# Altium project rj45_hub.PrjPcb
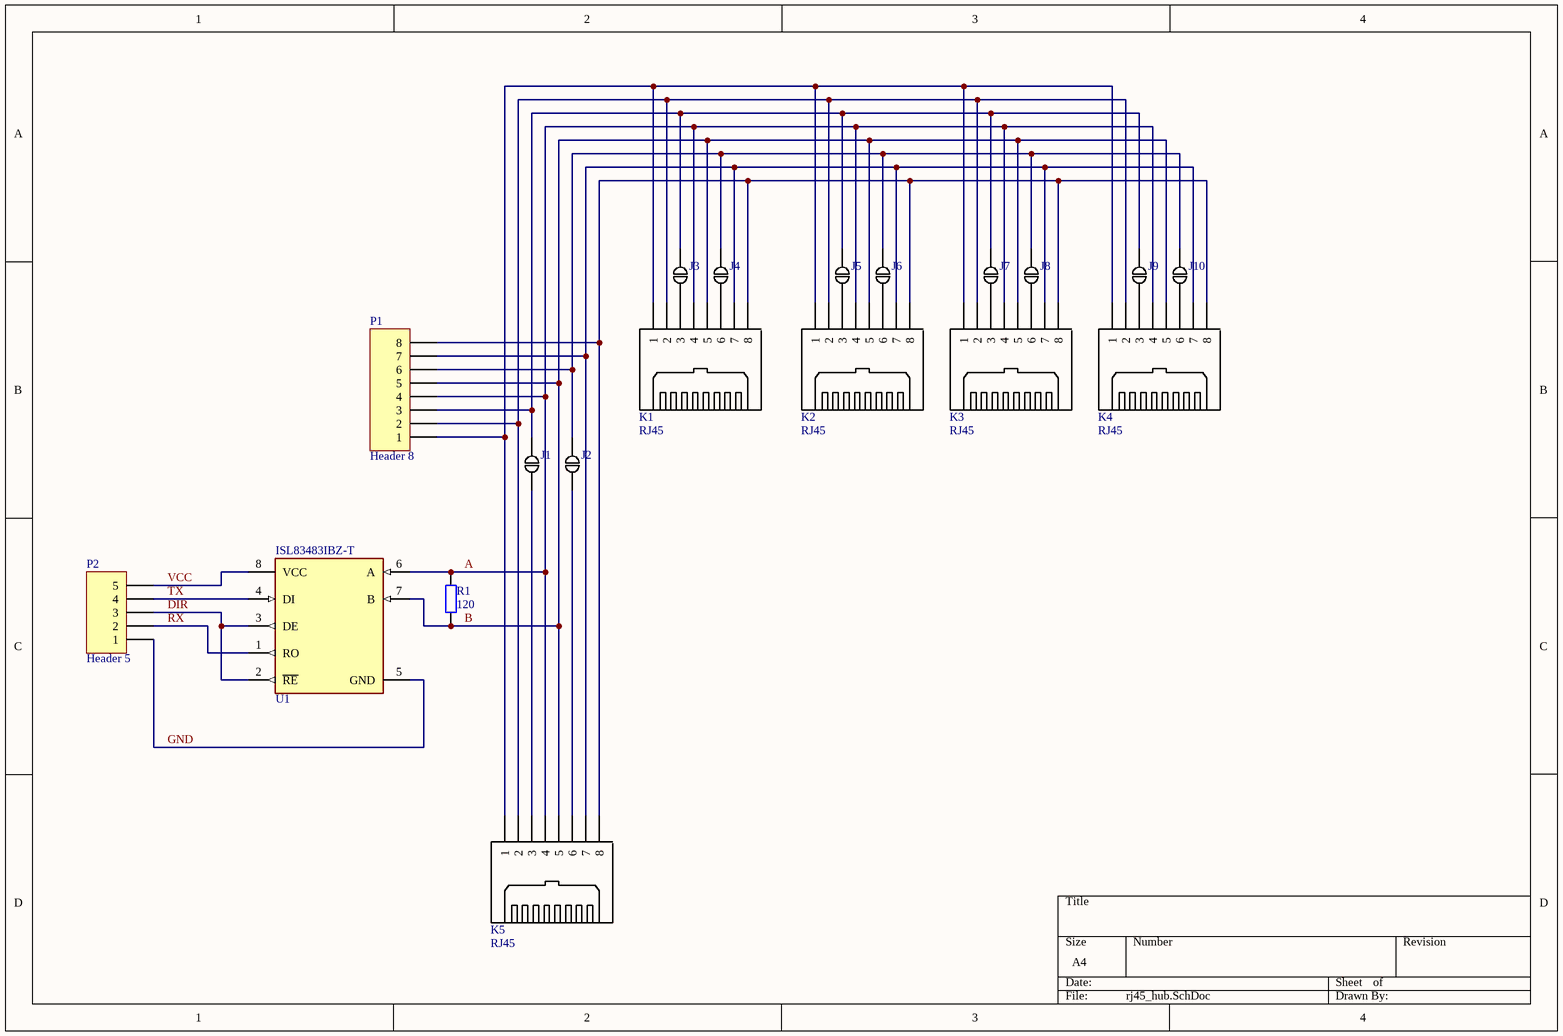
[diagram p0: rj45_hub.SchDoc]
1 sheet, 19 parts. Net scope: global (net labels, ports and power ports of the same name join across sheets).

## Sheet rj45_hub.SchDoc
size A4

### Parts
J1  (no value)  [SOLDER_JUMP]
J2  (no value)  [SOLDER_JUMP]
J3  (no value)  [SOLDER_JUMP]
J4  (no value)  [SOLDER_JUMP]
J5  (no value)  [SOLDER_JUMP]
J6  (no value)  [SOLDER_JUMP]
J7  (no value)  [SOLDER_JUMP]
J8  (no value)  [SOLDER_JUMP]
J9  (no value)  [SOLDER_JUMP]
J10  (no value)  [SOLDER_JUMP]
K1  RJ45  [rj45]
K2  RJ45  [rj45]
K3  RJ45  [rj45]
K4  RJ45  [rj45]
K5  RJ45  [rj45]
P1  Header 8  [HDR1X8]
P2  Header 5  [HDR1X5]
R1  value 120  [0603R-GENERIC]  (hidden comment: Res2)
U1  ISL83483IBZ-T  [FP-S8-5-MFG]

### Nets
A: K1.4 K2.4 K3.4 K4.4 K5.4 P1.4 R1.2 U1.6(A)
B: K1.5 K2.5 K3.5 K4.5 K5.5 P1.5 R1.1 U1.7(B)
DIR: P2.3 U1.2(~{RE}) U1.3(DE)
GND: P2.1 U1.5(GND)
RX: P2.2 U1.1(RO)
TX: P2.4 U1.4(DI)
VCC: P2.5 U1.8(VCC)
NetJ1_1: J1.1 J3.1 J5.1 J7.1 J9.1 P1.3
NetJ1_2: J1.2 K5.3
NetJ2_1: J2.1 J4.1 J6.1 J8.1 J10.1 P1.6
NetJ2_2: J2.2 K5.6
NetJ3_2: J3.2 K1.3
NetJ4_2: J4.2 K1.6
NetJ5_2: J5.2 K2.3
NetJ6_2: J6.2 K2.6
NetJ7_2: J7.2 K3.3
NetJ8_2: J8.2 K3.6
NetJ9_2: J9.2 K4.3
NetJ10_2: J10.2 K4.6
NetK1_1: K1.1 K2.1 K3.1 K4.1 K5.1 P1.1
NetK1_2: K1.2 K2.2 K3.2 K4.2 K5.2 P1.2
NetK1_7: K1.7 K2.7 K3.7 K4.7 K5.7 P1.7
NetK1_8: K1.8 K2.8 K3.8 K4.8 K5.8 P1.8

### Library data of the parts
J1-J10 = BYPASS-MINI: SOLDERDOT BYPASS; Manufacturer Part Number 1: Board Feature; Reel: Open; Supplier 1: Solder-it-yourself; Manufacturer 1: Board feature
K1-K5 = RJ45: Text Field1: STEWART CONNECTOR; Text Field2: SS-73100-047; Text Field3: DIGIKEY; Text Field4: 380-1053-ND
P1 = Header 8: Header, 8-Pin; LatestRevisionDate: 17-Jul-2002; LatestRevisionNote: Re-released for DXP Platform.; Publisher: Altium Limited
P2 = Header 5: Header, 5-Pin; LatestRevisionDate: 17-Jul-2002; LatestRevisionNote: Re-released for DXP Platform.; Publisher: Altium Limited
R1 = Res2: Resistor; Published: 8-Jun-2000; LatestRevisionDate: 17-Jul-2002; LatestRevisionNote: Re-released for DXP Platform.; PackageReference: AXIAL-0.4; Publisher: Altium Limited; PackageDescription: Axial Device, Thru-Hole; 2 Leads; 0.4 in Pin Spacing
U1 = CMP-05679-000034-1: IC TRANSCEIVER HALF 1/1 8SOIC; Manufacturer Part Number: MAX483ECSA+; Manufacturer: Maxim Integrated; Simplex Duplex: Half-Duplex; Standoff Height: 0.1mm; Number Of Receivers: 1; Min Supply Voltage: 4.75V; Interface: RS-485,RS-422; Data Rate: 2.5Mbits/s; Nominal Supply Current: 350uA; Max Supply Voltage: 5.25V; Temperature Range High: +70°C; Device Class L3: RS-232 / RS-422 / RS-485 Interface ICs; Package: S8-5; Device Class L2: Interface ICs; ComponentLink2Description: Datasheet; Automotive: No; Device Class L1: Integrated Circuits (ICs); Digikey Description: IC TRANSCEIVER HALF 1/1 8SOIC; RoHS: TRUE; Lead Free: Yes; Mouser Description: RS-422/RS-485 Interface IC RS-485/RS-422 Transceiver; Height: 1.75mm; ComponentLink2URL: https://datasheets.maximintegrated.com/en/ds/MAX1487E-MAX491E.pdf; Footprint Url: https://pdfserv.maximintegrated.com/land_patterns/90-0096.PDF; Octopart: https://octopart.com/max483ecsa%2B-maxim+integrated-39583309; Number Of Transmitters: 1; Category: IC; Temperature: 0°C to +70°C; Temperature Range Low: 0°C